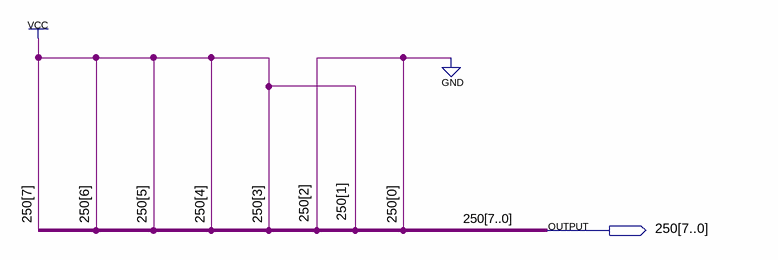
[diagram p0: schematic sheet]
// Quartus schematic quarters_250.bdf as structural Verilog: 0 symbols, 1 pins
module quarters_250 (
  output [7:0] \250 
);


  assign \250  = 8'b11111010;
endmodule
